# EAGLE design Pegelwandlung (EAGLE 6.4)
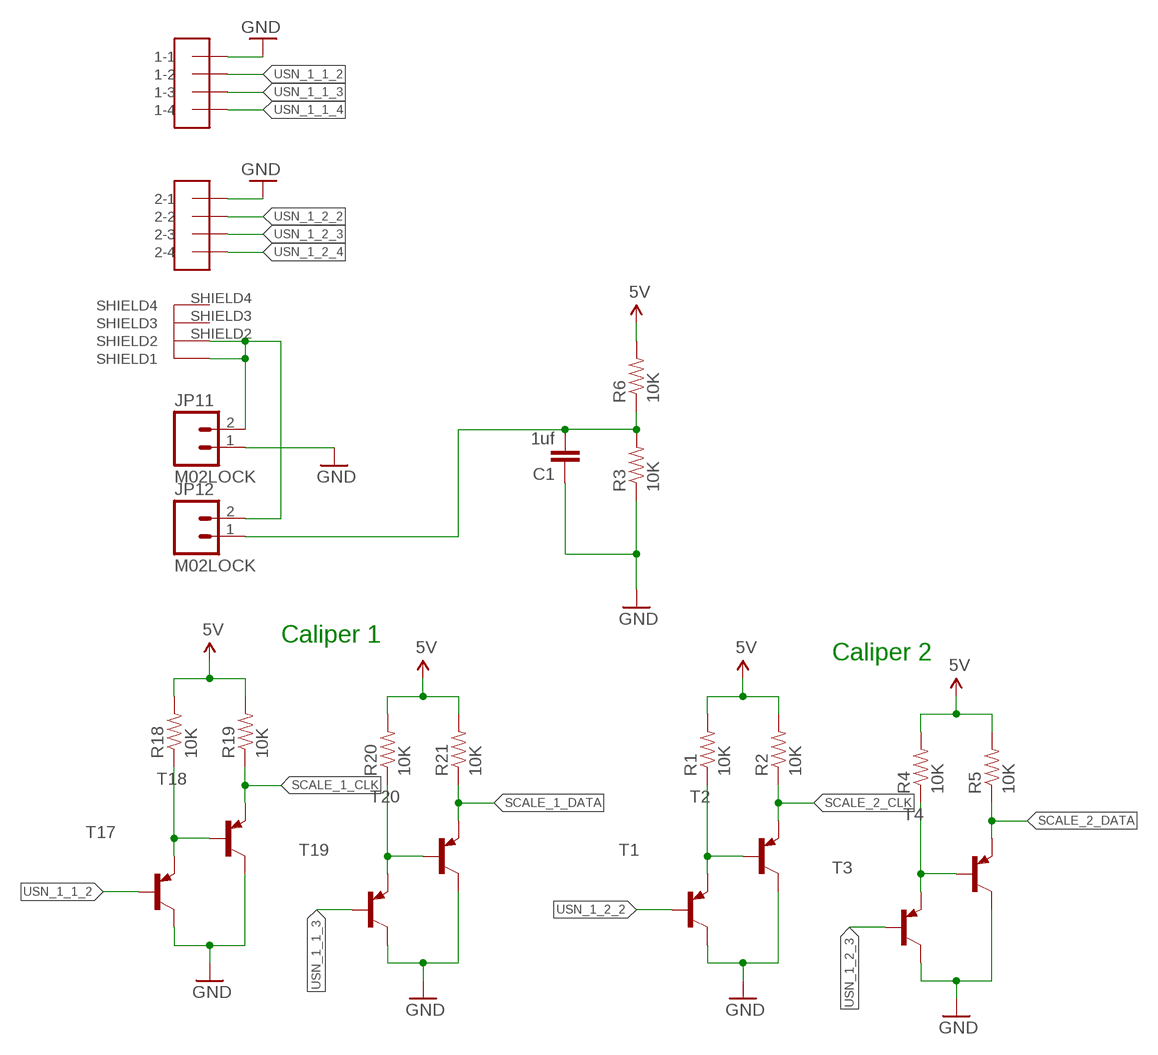
[diagram p0: schematic, sheet 1]

## Parts
C1  1uf  CAP0805  [0805]
JP11  M02LOCK  [1X02_LOCK]
JP12  M02LOCK  [1X02_LOCK]
R1  10K  RESISTOR0603-RES  [0603-RES]
R2  10K  RESISTOR0603-RES  [0603-RES]
R3  10K  RESISTOR0603-RES  [0603-RES]
R4  10K  RESISTOR0603-RES  [0603-RES]
R5  10K  RESISTOR0603-RES  [0603-RES]
R6  10K  RESISTOR0603-RES  [0603-RES]
R18  10K  RESISTOR0603-RES  [0603-RES]
R19  10K  RESISTOR0603-RES  [0603-RES]
R20  10K  RESISTOR0603-RES  [0603-RES]
R21  10K  RESISTOR0603-RES  [0603-RES]
T1  -PNP-SOT23-BCE  [SOT23-BCE]
T2  -PNP-SOT23-BCE  [SOT23-BCE]
T3  -PNP-SOT23-BCE  [SOT23-BCE]
T4  -PNP-SOT23-BCE  [SOT23-BCE]
T17  -PNP-SOT23-BCE  [SOT23-BCE]
T18  -PNP-SOT23-BCE  [SOT23-BCE]
T19  -PNP-SOT23-BCE  [SOT23-BCE]
T20  -PNP-SOT23-BCE  [SOT23-BCE]
U$7  USB-A-2  [USB-A-2]

## Nets
1.5V: C1.2 JP12.1 R3.2 R6.1
5V: R1.2 R2.2 R4.2 R5.2 R6.2 R18.2 R19.2 R20.2 R21.2
GND: C1.1 JP11.1 R3.1 T1.C T2.C T3.C T4.C T17.C T18.C T19.C T20.C U$7.1-1(USB-XA:1-1) U$7.2-1(USB-XB:2-1)
N$7: R1.1 T1.E T2.B
N$8: JP11.2 JP12.2 U$7.SHIELD1(SHIELD:SHIELD1) U$7.SHIELD2(SHIELD:SHIELD2)
N$10: R18.1 T17.E T18.B
N$12: R4.1 T3.E T4.B
N$16: R20.1 T19.E T20.B
SCALE_1_CLK: R19.1 T18.E
SCALE_1_DATA: R21.1 T20.E
SCALE_2_CLK: R2.1 T2.E
SCALE_2_DATA: R5.1 T4.E
USN_1_1_2: T17.B U$7.1-2(USB-XA:1-2)
USN_1_1_3: T19.B U$7.1-3(USB-XA:1-3)
USN_1_1_4: U$7.1-4(USB-XA:1-4)
USN_1_2_2: T1.B U$7.2-2(USB-XB:2-2)
USN_1_2_3: T3.B U$7.2-3(USB-XB:2-3)
USN_1_2_4: U$7.2-4(USB-XB:2-4)
Unconnected: U$7.SHIELD3(SHIELD:SHIELD3) U$7.SHIELD4(SHIELD:SHIELD4)

## Notes on the sheet
- Caliper 1
- Caliper 2

## Library data of the parts
C1 = SparkFun-Capacitors:CAP: Capacitor Standard 0603 ceramic capacitor, and 0.1" leaded capacitor.
JP11 JP12 = SparkFun-Connectors:M02: Standard 2-pin 0.1" header. Use with - straight break away headers ( PRT-00116) - right angle break away headers (PRT-00553) - swiss pins (PRT-00743) - machine pins (PRT-00117) - female headers (PRT-00115) Molex polarized connector foot print use with: PRT-08233 with associated crimp pins and housings. 2.54_SCREWTERM for use with PRT-10571. 3.5mm Screw Terminal footprints for PRT-08084 5mm Screw Terminal footprints for use with PRT-08433
R1-R6 R18-R21 = SparkFun-Resistors:RESISTOR: Resistor Basic schematic elements and footprints for 0603, 1206, and PTH resistors.
T1-T4 T17-T20 = transistor:*-PNP-: PNP Transistror
U$7 = usb:USB-A-2: Reichelt USB AW-2 http://www.reichelt.de/USB-FireWire-Verbinder/USB-AW-2/index.html?;ACTION=3;LA=444;GROUP=C1C;GROUPID=5208;ARTICLE=52004;START=0;SORT=id;OFFSET=100;SID=11TVAtpH8AAAIAAFKOLUob7739b188f91ab8cc657b33b81a56c4a

## Net classes
0 default: width 0.203 mm, clearance 0.205 mm

## Board
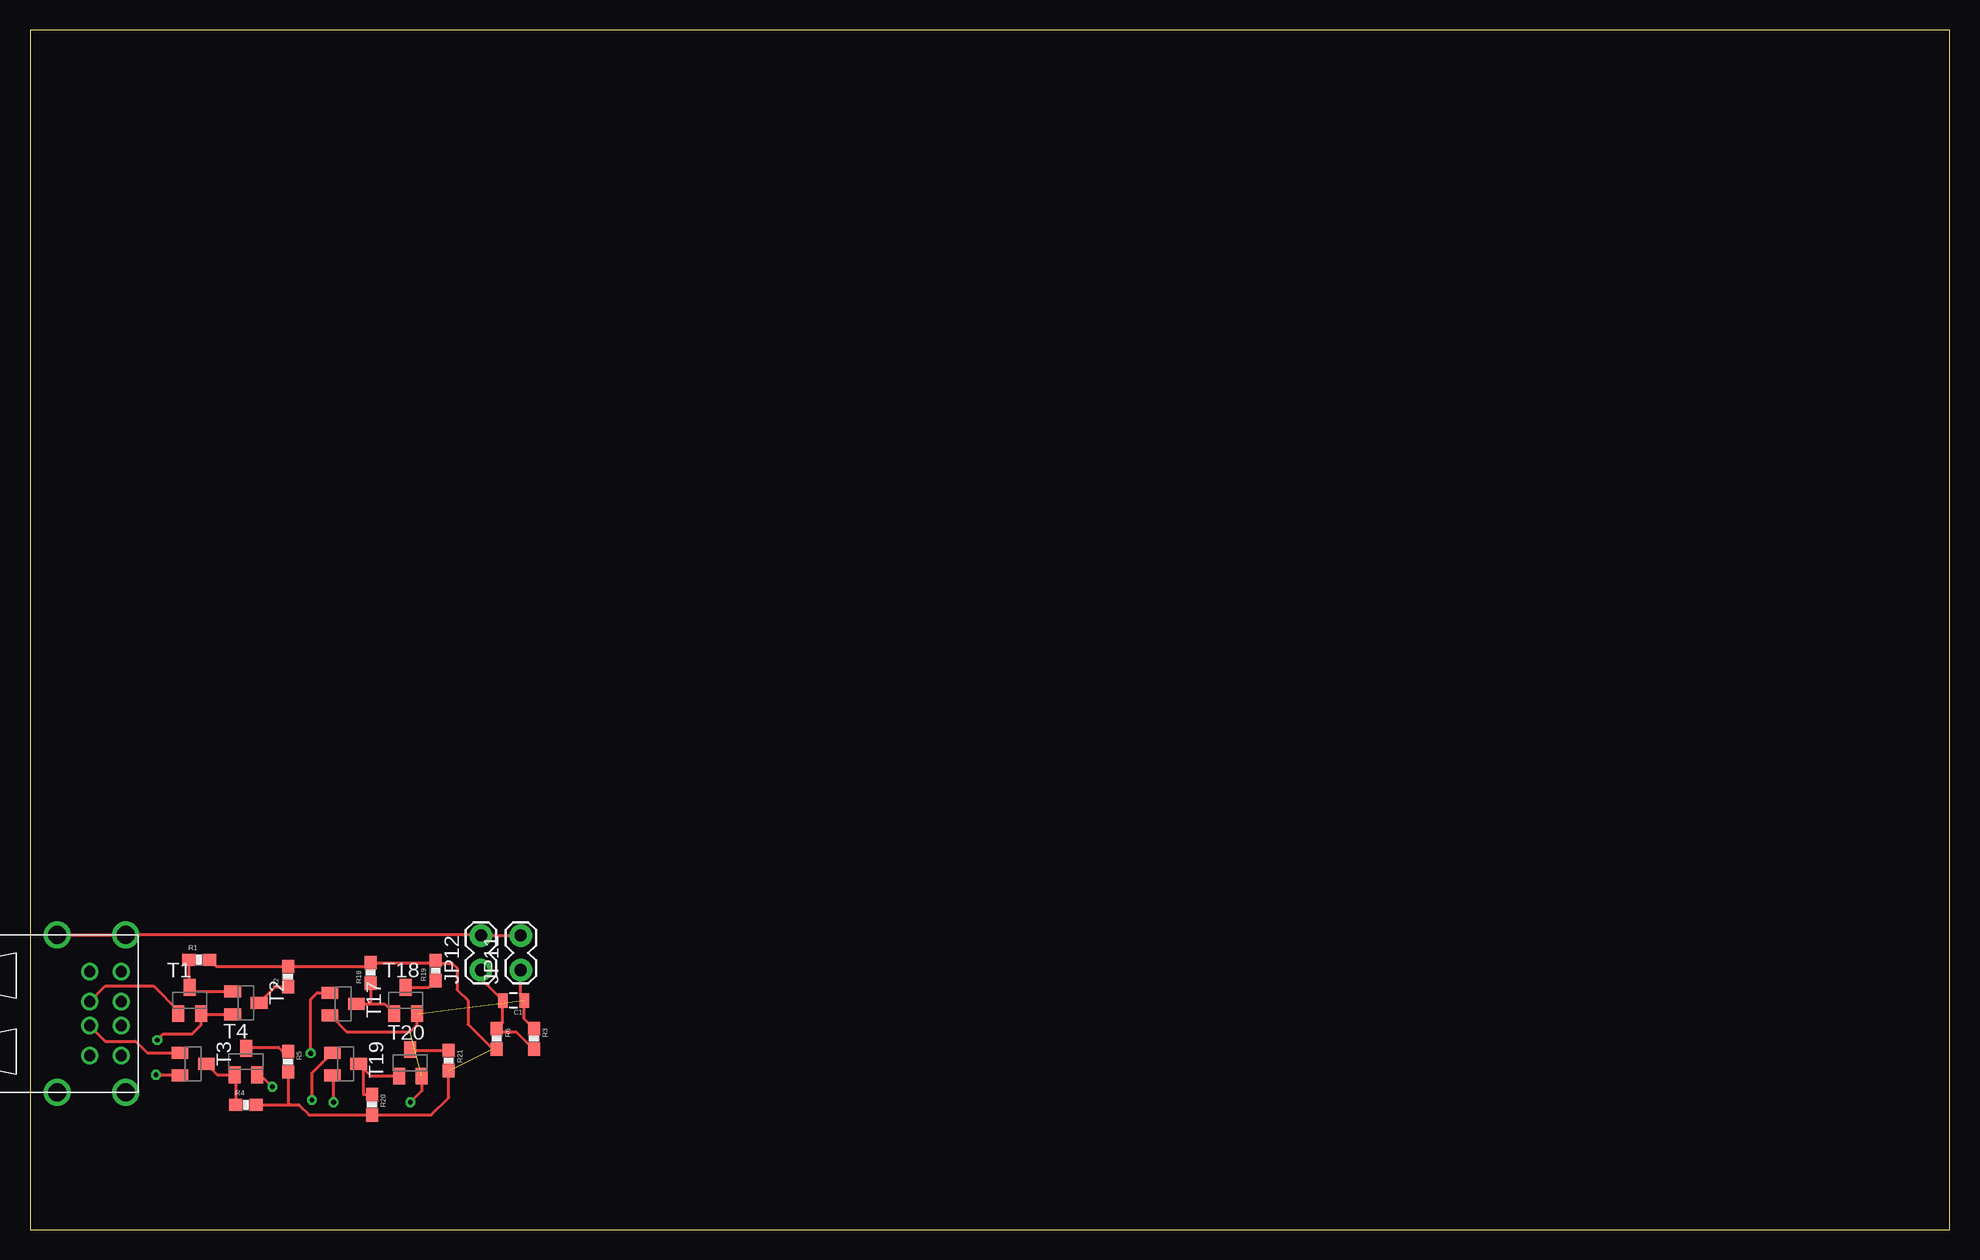
[diagram p1: board, top side]
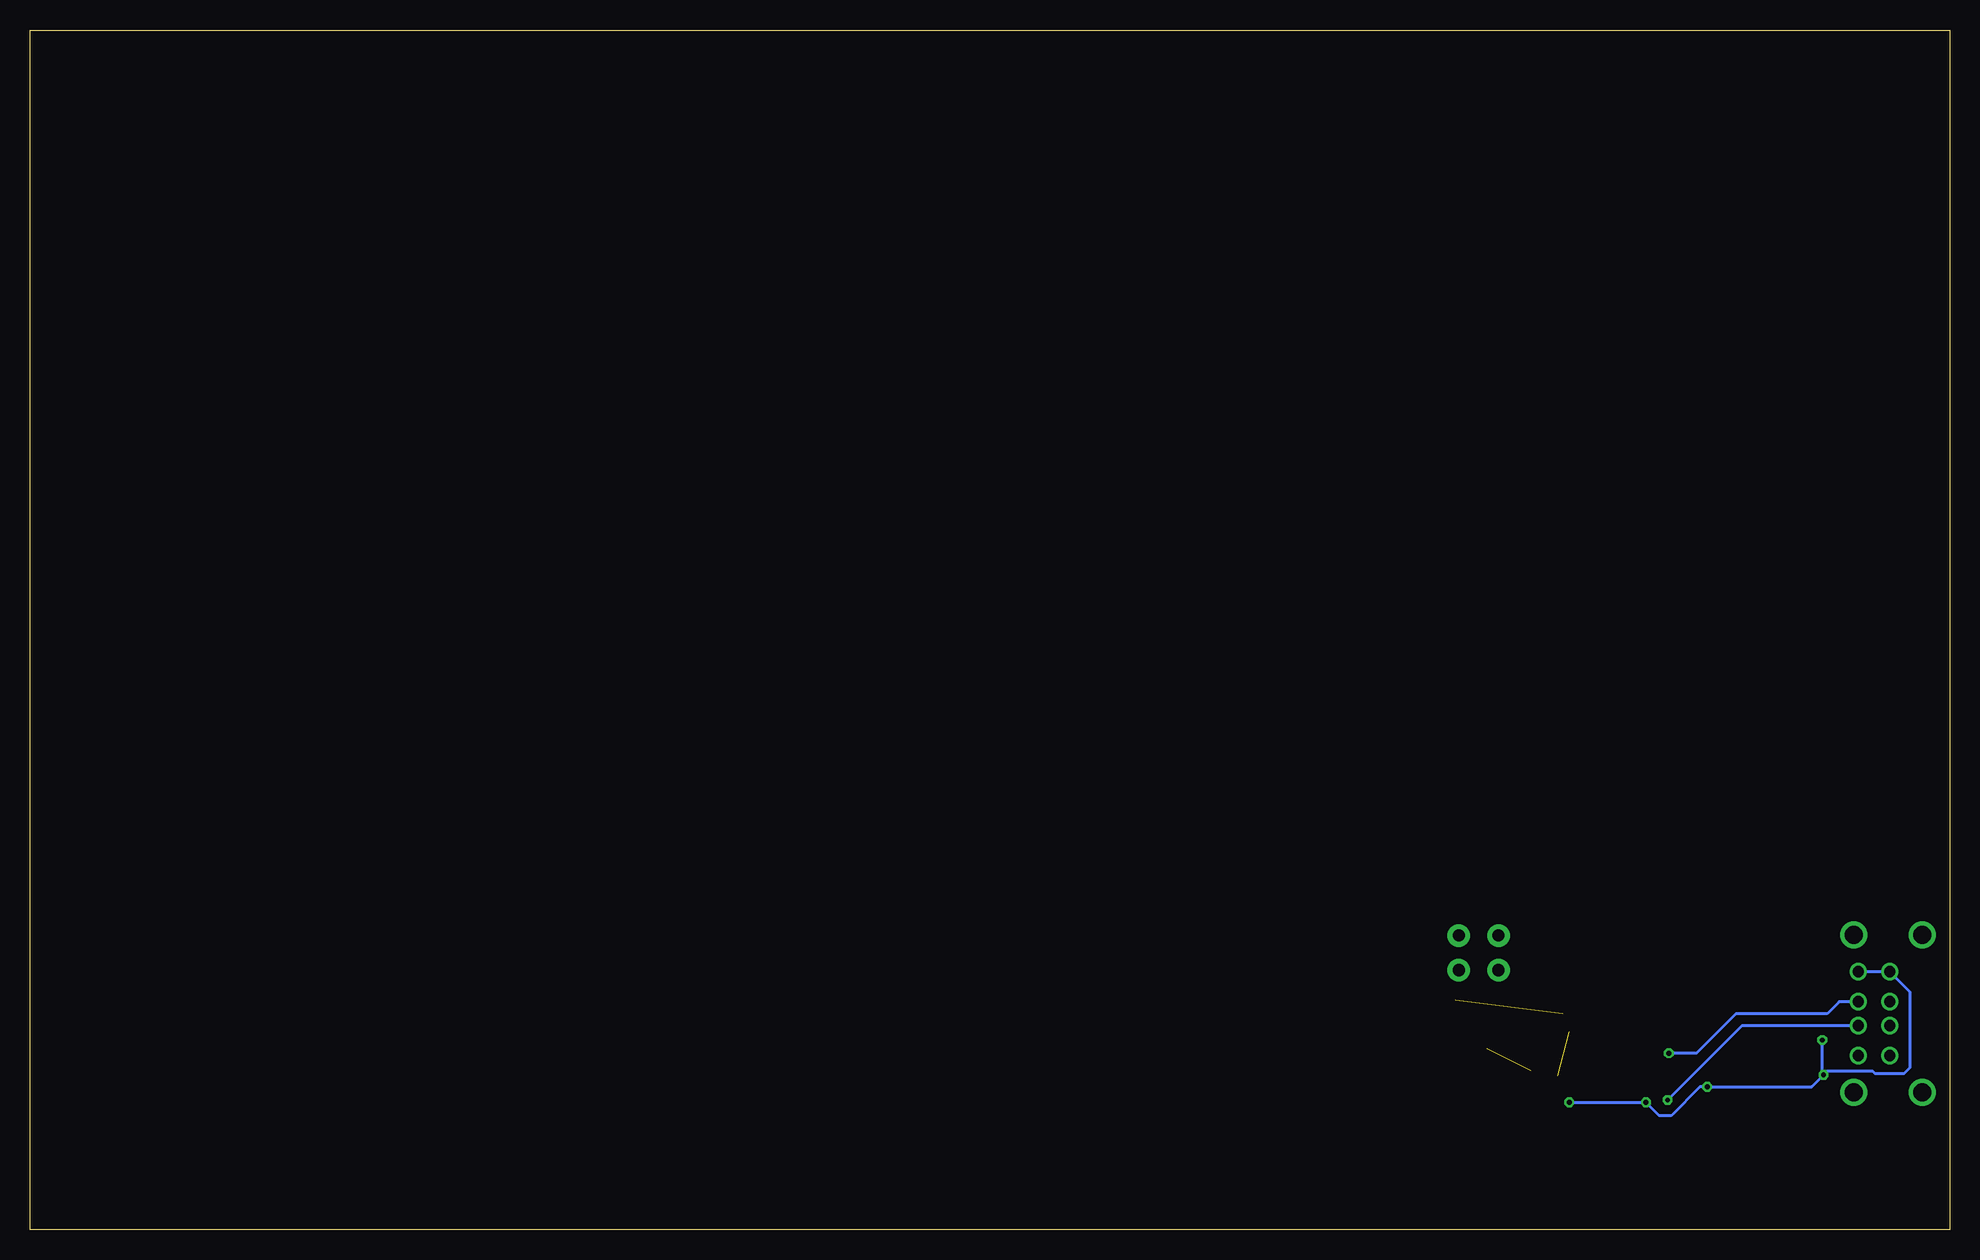
[diagram p2: board, bottom side, seen from below]

Size 160 x 100 mm. Coordinates in mm from the lower left corner, seen from the top.
Outline: 0,0 160,0 160,100 0,100 0,0
Copper layers (1*16): Top 0.035mm / dielectric 1.5mm / Bottom 0.035mm
Design rules "bilex-lp-eagle-rules": minimum track width 10mil, minimum drill 0.4mm, track to track 10mil, track to pad 10mil, pad to pad 10mil, via to via 10mil, smd to smd 10mil, copper to edge 0.5mm, drill to drill 10mil, minimum pad ring 10mil, minimum via ring 8mil, stop-mask expansion 0.075mm, vias tented up to drill 0mil, thermal gap 10mil

### Footprints (pad centres in the part's own frame; a part is rotated, then mirrored left to right if it is on the bottom)
0805 = smd 0.8 x 1.2: 1 -0.9,0; 2 0.9,0
1X02_LOCK = drill 1.016 pad 1.88: 1 -0.178,0; 2 2.718,0
0603-RES = smd 1.1 x 1: 1 -0.85,0; 2 0.85,0
SOT23-BCE = smd 1 x 1.4: B -0.95,-1.1; C 0.95,-1.1; E 0,1.1
USB-A-2 = drill 0.92: 1-1 -3.5,-1.39; 1-2 -1,-1.39; 1-3 1,-1.39; 1-4 3.5,-1.39; 2-1 -3.5,-4.01; 2-2 -1,-4.01; 2-3 1,-4.01; 2-4 3.5,-4.01 | drill 1.5: SHIELD1 -6.55,-1.04; SHIELD2 -6.55,-6.72; SHIELD3 6.55,-6.72; SHIELD4 6.55,-1.04

### Placement (x,y rotation side)
C1  40.3,19.1 180 top
JP11  40.9,21.8 90 top
JP12  37.6,21.8 90 top
R1  14.1,22.5 0 top
R2  21.5,21.1 90 top
R3  42,15.9 270 top
R4  18,10.4 0 top
R5  21.5,14 270 top
R6  38.9,15.9 270 top
R18  28.4,21.4 90 top
R19  33.8,21.6 90 top
R20  28.5,10.4 270 top
R21  34.9,14.1 270 top
T1  13.3,19.1 0 top
T2  18,18.9 270 top
T3  13.6,13.8 270 top
T4  18,14 0 top
T17  26.1,18.8 270 top
T18  31.3,19.1 0 top
T19  26.3,13.8 270 top
T20  31.7,13.9 0 top
U$7  9,18 270 top

### Tracks (layer width: path | path; a pad name or v marks a point on that pad's centre or on a via)
1.5V
  Top 0.254: JP12.1 37.6,20.9 C1.2 39.4,17.25 R6.1 39.15,16.5 40.5,16.5 41.95,15.05 R3.2
5V  (1 unrouted)
  Top 0.254: R1.2 15.5,21.95 R2.2 28.1,21.95 R18.2 33.6,22.25 R19.2 34.05,22.2 35.2,22.2 35.6,21.8 35.6,20 36.5,19.1 36.5,17.1 38.55,15.05 R6.2 | R4.2 21.5,10.4 | R21.2 34.9,11 33.45,9.55 R20.2 23.25,9.55 22.4,10.4 21.7,10.4 21.5,10.4 | R5.2 21.5,10.4
GND  (via drill 0.4)  (2 unrouted)
  Top 0.254: T2.C 14.3,17.95 T1.C 14.25,17.05 13.5,16.3 11.1,16.3 v10.6,15.8 | T3.C 10.5,12.85 v10.5,12.9 | T4.C 19.2,12.9 v20.2,11.9 | v25.3,10.6 25.3,12.75 T19.C | T20.C 32.65,11.55 v31.7,10.6 | T17.C 25.05,17.85 26.4,16.5 31.7,16.5 32.25,17.05 T18.C | R3.1 41.2,17.55 C1.1 40.9,19.4 JP11.1
  Bottom 0.254: v10.5,12.9 10.6,12.9 v10.6,15.8 | v10.5,12.9 10.2,13.2 6.4,13.2 6.2,13 3.8,13 3.3,13.5 3.3,19.81 U$7.2-1 U$7.1-1 | v10.5,12.9 11.5,11.9 v20.2,11.9 20.8,11.9 23.2,9.5 24.2,9.5 v25.3,10.6 v31.7,10.6
N$7
  Top 0.254: T2.B 13.65,19.85 T1.E 13.25,20.25 R1.1
N$8
  Top 0.254: U$7.SHIELD2 U$7.SHIELD1 37.57,24.55 JP12.2 JP11.2
N$10
  Top 0.254: T17.E 28.4,18.8 | 28.4,18.8 29.55,18.8 T18.B | R18.1 28.4,18.8
N$12
  Top 0.254: T3.E 15.6,12.9 T4.B 17.15,12.8 R4.1
N$16
  Top 0.254: 27.35,13.75 T19.E 27.8,13.4 | 27.8,13.4 28.4,12.8 T20.B | R20.1 27.8,11.25 27.8,13.4
SCALE_1_CLK
  Top 0.254: T18.E 33.25,20.2 R19.1
SCALE_1_DATA
  Top 0.254: T20.E 31.75,14.95 R21.1
SCALE_2_CLK
  Top 0.254: T2.E 20.45,20.25 R2.1
SCALE_2_DATA
  Top 0.254: T4.E 18.1,15.2 20.7,15.2 21.05,14.85 R5.1
USN_1_1_2  (via drill 0.4)
  Top 0.254: v23.4,14.7 23.4,19.2 23.95,19.75 T17.B
  Bottom 0.254: U$7.1-2 9.2,19 10.2,18 17.8,18 21.1,14.7 v23.4,14.7
USN_1_1_3  (via drill 0.4)
  Top 0.254: v23.5,10.8 23.5,13.05 T19.B
  Bottom 0.254: U$7.1-3 17.3,17 v23.5,10.8
USN_1_2_2
  Top 0.254: U$7.2-2 6.29,20.3 10.3,20.3 12.35,18.25 T1.B
USN_1_2_3
  Top 0.254: U$7.2-3 6.29,15.7 8.8,15.7 9.75,14.75 T3.B